# Altium schematic sheet THANHTRUNG.SchDoc
size A; SheetNumber: 1; SheetTotal: 1
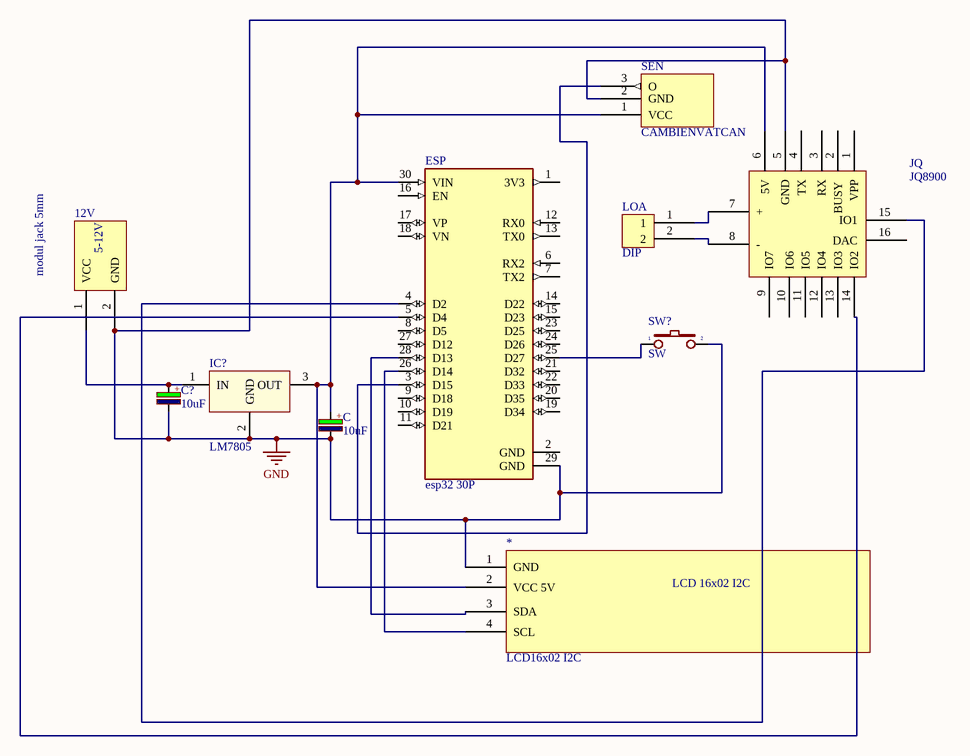
[diagram p0: THANHTRUNG.SchDoc]

## Parts
12V  modul jack 5mm  [ModulDC]
*  LCD16x02 I2C  [PCBComponent_1]
C  10uF  [CP1/2]
C?  10uF  [CP1/2]
ESP  esp32 30P  [MODULE_ESP32_DEVKIT_V1]
IC?  LM7805  [QTO-220]
JQ  JQ8900  [PCBComponent_1]
LOA  DIP  [PCBComponent_1]
SEN  CAMBIENVATCAN  [PCBComponent_1]
SW?  SW  [SW2]

## Nets
GND: 12V.2(GND) *.1(GND) C.2 C?.2 ESP.29(GND) IC?.2(GND) JQ.5(GND) SEN.2(GND) SW?.2
Net12V_1: 12V.1(VCC) C?.1 IC?.1(IN)
Net*_2: *.2(VCC_5V) C.1 ESP.30(VIN) IC?.3(OUT) JQ.6(5V) SEN.1(VCC)
Net*_3: *.3(SDA) ESP.28(D13)
Net*_4: *.4(SCL) ESP.26(D14)
NetESP_3: ESP.3(D15) SEN.3(O)
NetESP_4: ESP.4(D2) JQ.15(IO1)
NetESP_5: ESP.5(D4) JQ.14(IO2)
NetESP_25: ESP.25(D27) SW?.1
NetJQ_7: JQ.7(+) LOA.1
NetJQ_8: JQ.8(-) LOA.2

Not connected (* = marked no-connect by the designer): ESP 1(3V3) 2(GND) 6(RX2) 7(TX2) 8(D5) 9(D18) 10(D19) 11(D21) 12(RX0) 13(TX0) 14(D22) 15(D23) 16(EN) 17(VP) 18(VN) 19(D34) 20(D35) 21(D32) 22(D33) 23(D25) 24(D26) 27(D12); JQ 1(VPP) 2(BUSY_) 3(RX) 4(TX) 9(IO7) 10(IO6) 11(IO5) 12(IO4) 13(IO3) 16(DAC)

## Notes on the sheet
- (in symbol CP0) +
- (in symbol LCD16x02 I2C) LCD 16x02 I2C
- (in symbol modul jack 5mm) 5-12V

## Library data of the parts
C C? = CP0: Cap P  0,1uF < 22uF , 16 - 50V; Value: 10uF/50V; Description 1: 10 => 220uF/6,3V/10V - 10uF => 100uF/16V; Description 2: 0,1uF => 33uF/50V - 10uF => 22uF/63V; Description 3: 0,47uF => 10uF/100V
IC? = LM78xx: On ap +, from + 5 to + 24VDC; Value: LM7805
SW? = SW2: Switch button 2 pin; Value: SW chip 2 pin